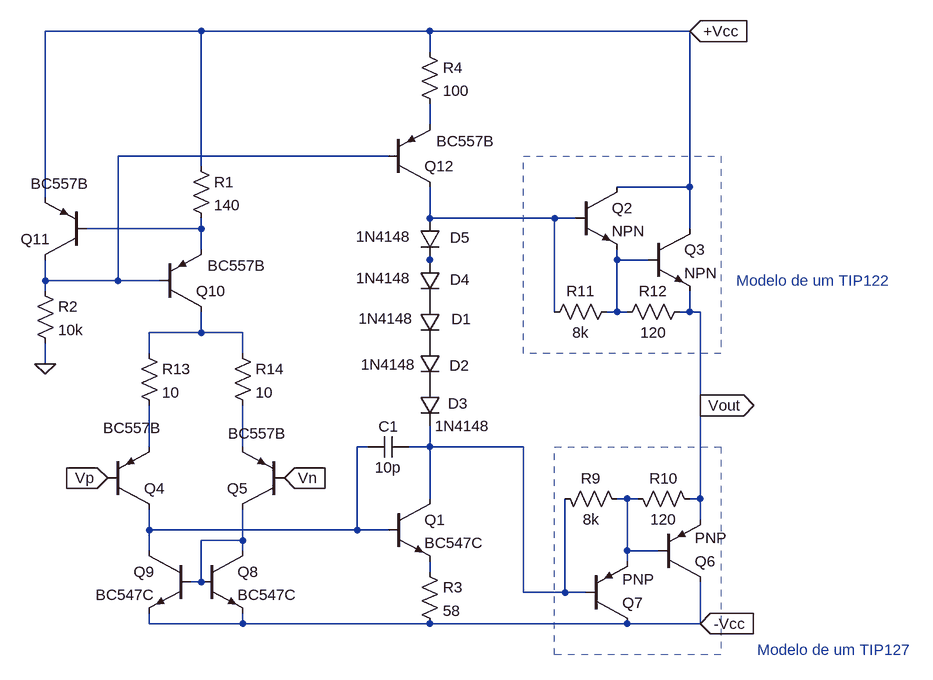
[diagram p0: schematic AudioAmpFonteResistencia.asc]
AudioAmpFonteResistencia.asc, the LTspice schematic file:
Version 4
SHEET 1 1444 680
WIRE -64 -528 -304 -528
WIRE 288 -528 -64 -528
WIRE 688 -528 288 -528
WIRE 288 -496 288 -528
WIRE 288 -384 288 -416
WIRE 224 -336 -192 -336
WIRE -64 -320 -64 -528
WIRE 688 -288 688 -528
WIRE 688 -288 576 -288
WIRE -304 -272 -304 -528
WIRE 288 -240 288 -288
WIRE 480 -240 288 -240
WIRE 512 -240 480 -240
WIRE -64 -224 -64 -240
WIRE -64 -224 -240 -224
WIRE 688 -224 688 -288
WIRE -64 -192 -64 -224
WIRE 288 -176 288 -192
WIRE 576 -176 576 -192
WIRE 624 -176 576 -176
WIRE -304 -144 -304 -176
WIRE -192 -144 -192 -336
WIRE -192 -144 -304 -144
WIRE -128 -144 -192 -144
WIRE -304 -128 -304 -144
WIRE 480 -96 480 -240
WIRE 576 -96 576 -176
WIRE 576 -96 560 -96
WIRE 592 -96 576 -96
WIRE 688 -96 688 -128
WIRE 688 -96 672 -96
WIRE 704 -96 688 -96
WIRE -64 -64 -64 -96
WIRE -64 -64 -144 -64
WIRE 0 -64 -64 -64
WIRE -144 -32 -144 -64
WIRE 0 -32 0 -64
WIRE -304 -16 -304 -48
WIRE 704 48 704 -96
WIRE -144 112 -144 48
WIRE 0 112 0 48
WIRE 192 112 176 112
WIRE 288 112 288 80
WIRE 288 112 256 112
WIRE 432 112 288 112
WIRE 288 192 288 112
WIRE 592 192 576 192
WIRE 608 192 592 192
WIRE 704 192 704 48
WIRE 704 192 688 192
WIRE 704 224 704 192
WIRE -144 240 -144 208
WIRE 176 240 176 112
WIRE 176 240 -144 240
WIRE 224 240 176 240
WIRE 0 256 0 208
WIRE 0 256 -64 256
WIRE -144 272 -144 240
WIRE 0 272 0 256
WIRE 592 272 592 192
WIRE 640 272 592 272
WIRE 592 288 592 272
WIRE 288 304 288 288
WIRE -64 320 -64 256
WIRE -64 320 -80 320
WIRE 432 336 432 112
WIRE 496 336 496 192
WIRE 496 336 432 336
WIRE 528 336 496 336
WIRE -144 384 -144 368
WIRE 0 384 0 368
WIRE 0 384 -144 384
WIRE 288 384 0 384
WIRE 592 384 288 384
WIRE 704 384 704 320
WIRE 704 384 592 384
FLAG 688 -528 +Vcc
IOPIN 688 -528 In
FLAG 704 384 -Vcc
IOPIN 704 384 In
FLAG 704 48 Vout
IOPIN 704 48 Out
FLAG -208 160 Vp
IOPIN -208 160 In
FLAG 64 160 Vn
IOPIN 64 160 In
FLAG -304 -16 0
SYMBOL pnp -208 208 M180
WINDOW 3 -7 125 Left 2
SYMATTR Value BC557B
SYMATTR InstName Q4
SYMBOL pnp 64 208 R180
WINDOW 3 -3 117 Left 2
SYMATTR Value BC557B
SYMATTR InstName Q5
SYMBOL res 480 176 M90
WINDOW 0 0 56 VBottom 2
WINDOW 3 32 56 VTop 2
SYMATTR InstName R9
SYMATTR Value 8k
SYMBOL res 592 176 M90
WINDOW 0 0 56 VBottom 2
WINDOW 3 32 56 VTop 2
SYMATTR InstName R10
SYMATTR Value 120
SYMBOL npn 512 -288 R0
SYMATTR InstName Q2
SYMBOL npn 624 -224 R0
SYMATTR InstName Q3
SYMBOL res 464 -80 R270
WINDOW 0 32 56 VTop 2
WINDOW 3 0 56 VBottom 2
SYMATTR InstName R11
SYMATTR Value 8k
SYMBOL res 576 -80 R270
WINDOW 0 32 56 VTop 2
WINDOW 3 0 56 VBottom 2
SYMATTR InstName R12
SYMATTR Value 120
SYMBOL pnp 640 320 M180
SYMATTR InstName Q6
SYMBOL pnp 528 384 M180
SYMATTR InstName Q7
SYMBOL npn 224 192 R0
SYMATTR InstName Q1
SYMATTR Value BC547C
SYMBOL cap 256 96 R90
WINDOW 0 0 32 VBottom 2
WINDOW 3 32 32 VTop 2
SYMATTR InstName C1
SYMATTR Value 10p
SYMBOL diode 272 -112 R0
WINDOW 0 49 27 Left 2
WINDOW 3 -94 26 Left 2
SYMATTR InstName D1
SYMATTR Value 1N4148
SYMBOL diode 272 -48 R0
WINDOW 0 46 35 Left 2
WINDOW 3 -90 33 Left 2
SYMATTR InstName D2
SYMATTR Value 1N4148
SYMBOL diode 272 16 R0
WINDOW 0 44 29 Left 2
SYMATTR InstName D3
SYMATTR Value 1N4148
SYMBOL diode 272 -176 R0
WINDOW 0 47 30 Left 2
WINDOW 3 -98 28 Left 2
SYMATTR InstName D4
SYMATTR Value 1N4148
SYMBOL diode 272 -240 R0
WINDOW 0 47 30 Left 2
WINDOW 3 -98 28 Left 2
SYMATTR InstName D5
SYMATTR Value 1N4148
SYMBOL res -160 -48 R0
SYMATTR InstName R13
SYMATTR Value 10
SYMBOL res -16 -48 R0
SYMATTR InstName R14
SYMATTR Value 10
SYMBOL npn -64 272 R0
SYMATTR InstName Q8
SYMATTR Value BC547C
SYMBOL npn -80 272 M0
SYMATTR InstName Q9
SYMATTR Value BC547C
SYMBOL pnp -128 -96 M180
WINDOW 3 74 71 Left 2
SYMATTR Value BC557B
SYMATTR InstName Q10
SYMBOL pnp -240 -176 R180
WINDOW 3 -3 117 Left 2
SYMATTR Value BC557B
SYMATTR InstName Q11
SYMBOL res -80 -336 R0
SYMATTR InstName R1
SYMATTR Value 140
SYMBOL res -320 -144 R0
SYMATTR InstName R2
SYMATTR Value 10k
SYMBOL res 272 -512 R0
SYMATTR InstName R4
SYMATTR Value 100
SYMBOL pnp 224 -288 M180
WINDOW 3 74 71 Left 2
SYMATTR Value BC557B
SYMATTR InstName Q12
SYMBOL res 272 288 R0
SYMATTR InstName R3
SYMATTR Value 58
TEXT 760 -144 Left 2 ;Modelo de um TIP122
TEXT 792 424 Left 2 ;Modelo de um TIP127
RECTANGLE Normal 736 432 480 112 2
RECTANGLE Normal 736 -32 432 -336 2

The netlist it stands for:
* AudioAmpFonteResistencia.asc
Q4 N010 Vp N008 0 BC557B
Q5 N013 Vn N009 0 BC557B
R9 N011 N012 8k
R10 N012 Vout 120
Q2 +Vcc N003 N006 0 NPN
Q3 +Vcc N006 Vout 0 NPN
R11 N003 N006 8k
R12 N006 Vout 120
Q6 -Vcc N012 Vout 0 PNP
Q7 -Vcc N011 N012 0 PNP
Q1 N011 N010 N014 0 BC547C
C1 N011 N010 10p
D1 P001 P002 1N4148
D2 P002 P003 1N4148
D3 P003 N011 1N4148
D4 N005 P001 1N4148
D5 N003 N005 1N4148
R13 N007 N008 10
R14 N007 N009 10
Q8 N013 N013 -Vcc 0 BC547C
Q9 N010 N013 -Vcc 0 BC547C
Q10 N007 N002 N004 0 BC557B
Q11 N002 N004 +Vcc 0 BC557B
R1 +Vcc N004 140
R2 N002 0 10k
R4 +Vcc N001 100
Q12 N003 N002 N001 0 BC557B
R3 N014 -Vcc 58
.model D D
.lib standard.dio
.model NPN NPN
.model PNP PNP
.lib standard.bjt
* Modelo de um TIP122
* Modelo de um TIP127
.backanno
.end